# EAGLE design Finger Print Scanner (EAGLE 9.0.0)

## Sheet 1 of 2
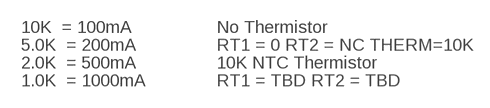
[diagram p0: schematic, sheet 1, part 1 of 2]
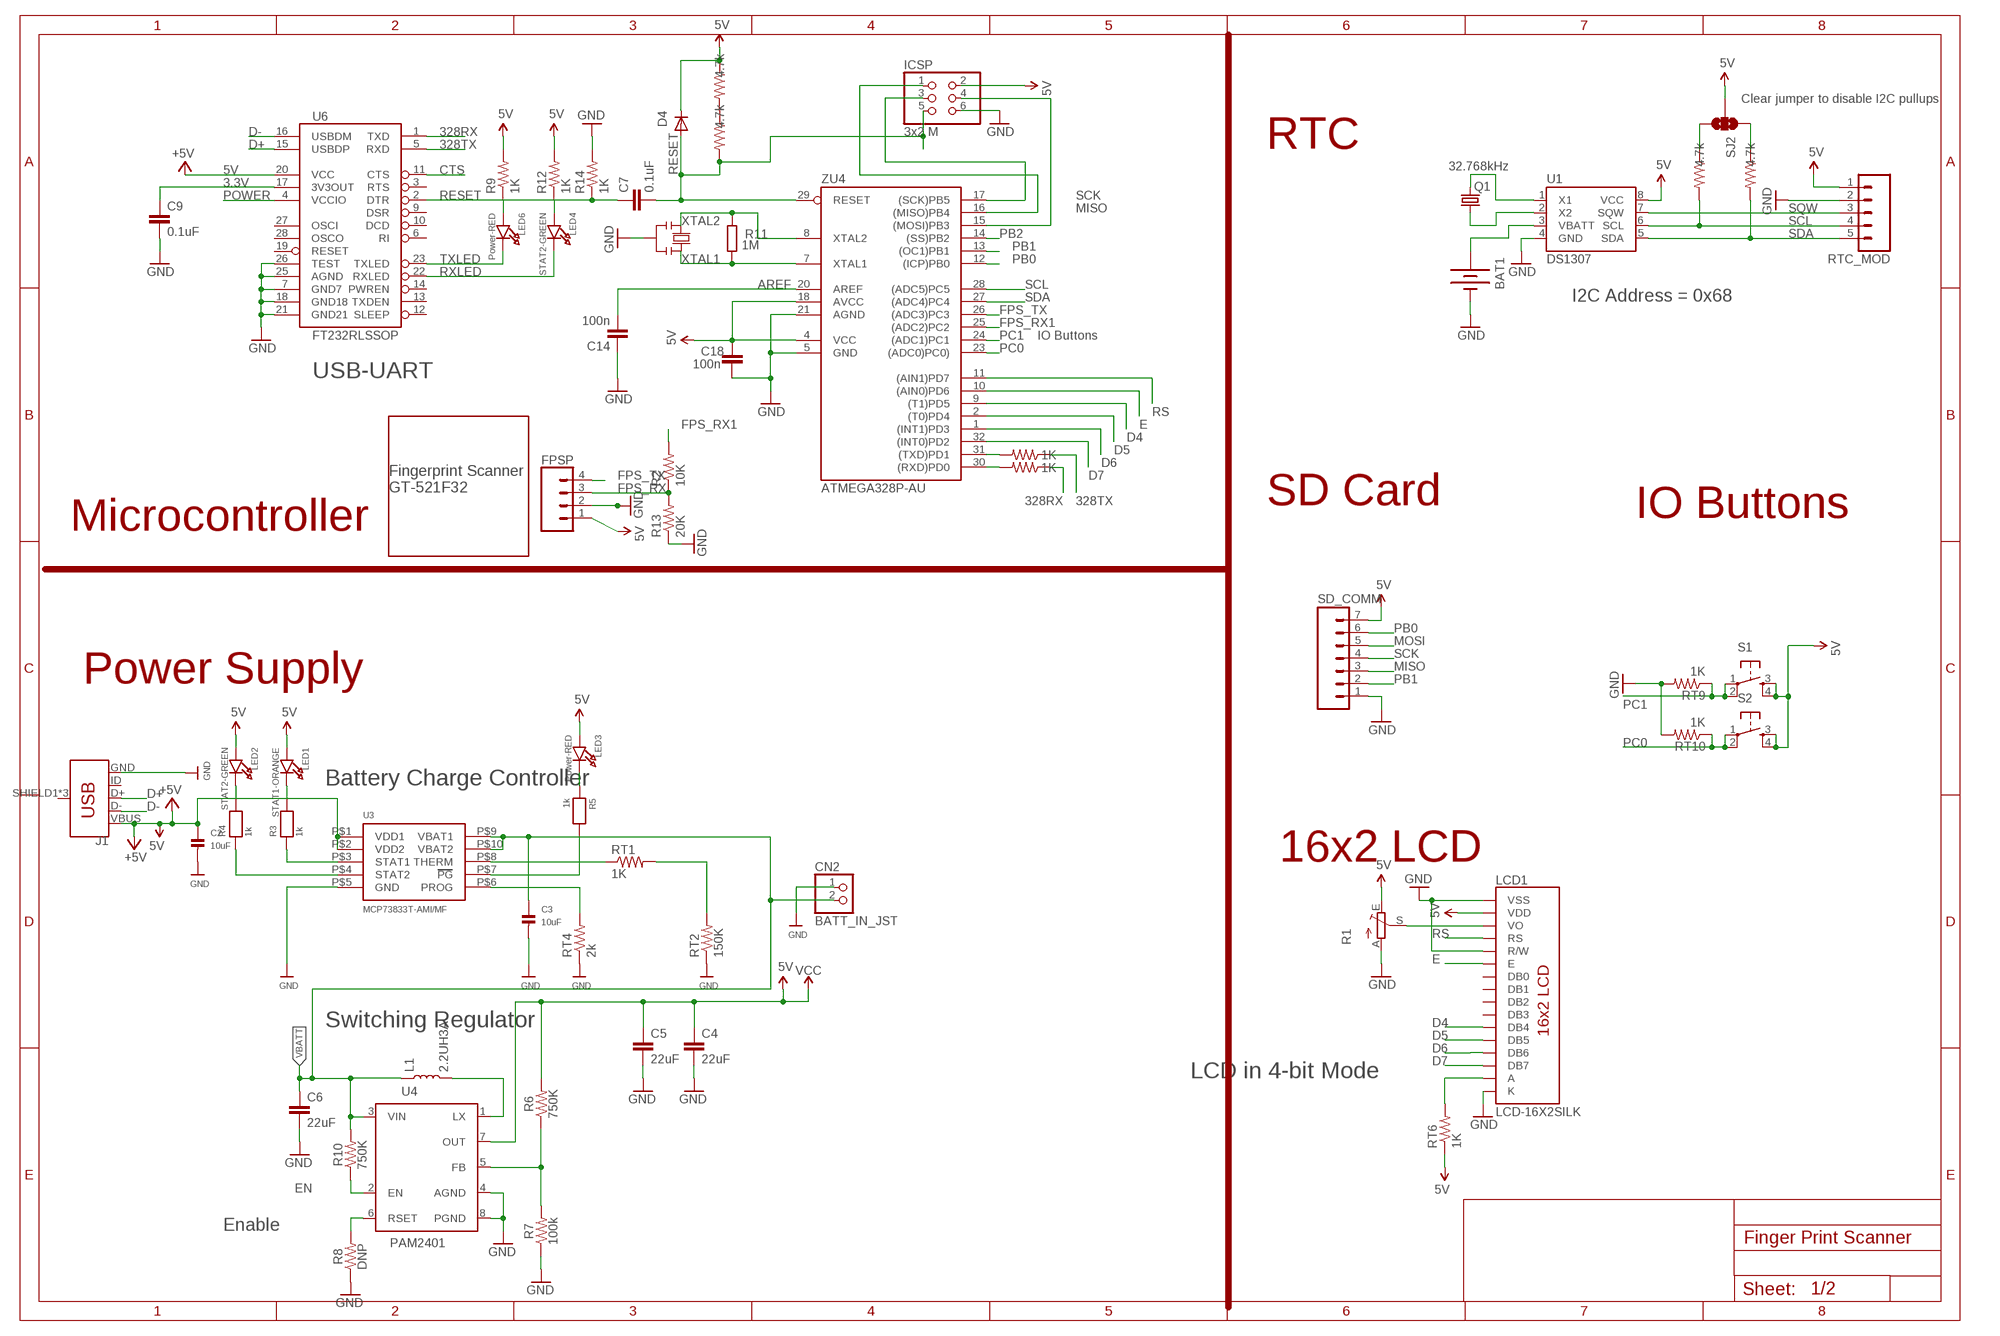
[diagram p1: schematic, sheet 1, part 2 of 2]

### Parts
BAT1  BATTERY12PTH  [BATTCON_12MM_PTH]
C2  10uF  CAP_CERAMIC0805  [0805]
C3  10uF  CAP_CERAMIC0805  [0805]
C4  22uF  22UF-0805-6.3V-20%  [0805]
C5  22uF  22UF-0805-6.3V-20%  [0805]
C6  22uF  22UF-0805-6.3V-20%  [0805]
C7  0.1uF  CAP0805  [0805]
C9  0.1uF  CAP0805  [0805]
C14  100n  C-EUC0805  [C0805]
C18  100n  C-EUC0805  [C0805]
CN2  BATT_IN_JST  JST_2PIN  [JSTPH2]
D4  DIODE-MINIMELF  [MINIMELF]
FPSP  CONN_04  [1X04]
ICSP  3x2 M  PINHD-2X3  [2X03]
J1  USB_MICRO-B_FEMALE-SMT  [USB-B-MICRO-SMD]
L1  2.2UH3A  INDUCTOR-IFSC1515AHER2R2M01  [INDUCTOR_4X4MM]
LCD1  LCD-16X2SILK  [LCD-16X2]
LED1  STAT1-ORANGE  LED0805  [CHIPLED_0805]
LED2  STAT2-GREEN  LED0805  [CHIPLED_0805]
LED3  Power-RED  LED0805  [CHIPLED_0805]
LED4  STAT2-GREEN  LED0805  [CHIPLED_0805]
LED6  Power-RED  LED0805  [CHIPLED_0805]
Q1  32.768kHz  CRYSTAL32-SMD  [CRYSTAL-32KHZ-SMD]
R1  TRIM_EU-CA6V  [CA6V]
R2  10K  RESISTOR0805-RES  [0805]
R3  1k  RESISTOR0805  [0805]
R4  1k  RESISTOR0805  [0805]
R5  1k  RESISTOR0805  [0805]
R6  750K  750KOHM-0603-1/10W-1%  [0603]
R7  100k  100KOHM-0603-1/10W-1%  [0603]
R8  DNP  100KOHM-0603-1/10W-1%  [0603]
R9  1K  RESISTOR0805-RES  [0805]
R10  750K  750KOHM-0603-1/10W-1%  [0603]
R11  1M  R-EU_R0805  [R0805]
R12  1K  RESISTOR0805-RES  [0805]
R13  20K  RESISTOR0805-RES  [0805]
R14  1K  RESISTOR0805-RES  [0805]
RT1  1K  R-US_R0805  [R0805]
RT2  150K  R-US_R0805  [R0805]
RT4  2k  R-US_R0805  [R0805]
RT6  1K  R-US_R0805  [R0805]
RT9  1K  R-US_R0805  [R0805]
RT10  1K  R-US_R0805  [R0805]
RT11  1K  R-US_R0805  [R0805]
RT12  1K  R-US_R0805  [R0805]
RT13  4.7k  R-US_R0805  [R0805]
RT14  4.7k  R-US_R0805  [R0805]
RT15  4.7k  R-US_R0805  [R0805]
RT16  4.7k  R-US_R0805  [R0805]
RTC_MOD  M05PTH  [1X05]
S1  TAC_SWITCHPTH  [TACTILE-PTH]
S2  TAC_SWITCHPTH  [TACTILE-PTH]
SD_COMM  M07  [1X07]
SJ2  SOLDERJUMPER_2WAYPASTE1&2&3  [SJ_3_PASTE1&2&3]
U1  DS1307  DS1307SO8-TIGHT  [SO08-TIGHT]
U3  MCP73833T-AMI/MF  MCP73833DFN  [DFN10_3X3MM]
U4  PAM2401  [MSOP8]
U6  FT232RLSSOP  [SSOP28DB]
U$1  GT-521F32  [GT-521F32]
Y2  RESONATORMU  [RESONATOR]
ZU4  ATMEGA328P-AU  [TQFP32-08]

### Nets
3.3V: C9.1 U6.17(3V3OUT)
5V: C2.1 C4.1 C5.1 C18.2 D4.C FPSP.1 ICSP.2 J1.VBUS LCD1.2(VDD) LED1.A LED2.A LED3.A R1.E R6.2 R9.2 R12.2 RT6.1 RT16.1 RTC_MOD.1 S1.3 S1.4 S2.3 S2.4 SD_COMM.7 SJ2.2 U1.8(VCC) U3.P$1(VDD1) U3.P$2(VDD2) U4.7(OUT) U6.20(VCC) ZU4.4(VCC) ZU4.18(AVCC) ; supply symbol labelled VCC, +5V ; also sheet 2
328RX: RT11.1 U6.1(TXD)
328RXI: RT11.2 ZU4.30((RXD)PD0)
328TX: RT12.1 U6.5(RXD)
328TXI: RT12.2 ZU4.31((TXD)PD1)
AREF [aref]: C14.2 ZU4.20(AREF)
CTS: U6.11(CTS)
D4: LCD1.11(DB4) ZU4.9((T1)PD5)
D5: LCD1.12(DB5) ZU4.2((T0)PD4)
D6: LCD1.13(DB6) ZU4.1((INT1)PD3)
D7: LCD1.14(DB7) ZU4.32((INT0)PD2)
D+: J1.D+ U6.15(USBDP)
D-: J1.D- U6.16(USBDM)
E: LCD1.6(E) ZU4.10((AIN0)PD6)
EN: R10.1 U4.2(EN)
FPS_RX: FPSP.3 R2.1 R13.2
FPS_RX1: R2.2 ZU4.25((ADC2)PC2)
FPS_TX: FPSP.4 ZU4.26((ADC3)PC3)
GND: BAT1.GND(-) C2.2 C3.2 C4.2 C5.2 C6.2 C9.2 C14.1 C18.1 CN2.1 FPSP.2 ICSP.6 J1.GND LCD1.1(VSS) LCD1.5(R/W) LCD1.16(K) R1.A R7.1 R8.1 R13.1 R14.2 RT2.1 RT4.1 RT9.2 RT10.2 RTC_MOD.2 SD_COMM.1 U1.4(GND) U3.P$5(GND) U4.4(AGND) U4.8(PGND) U6.7(GND7) U6.18(GND18) U6.21(GND21) U6.25(AGND) U6.26(TEST) Y2.2 ZU4.5(GND) ZU4.21(AGND) ; also sheet 2
MISO: ICSP.1 SD_COMM.3 ZU4.16((MISO)PB4)
MOSI: ICSP.4 SD_COMM.5 ZU4.15((MOSI)PB3)
N$1: Q1.X2 U1.1(X1)
N$2: Q1.X1 U1.2(X2)
N$3: LED1.C R3.2
N$4: BAT1.VCC@1(+) U1.3(VBATT)
N$5: RT13.1 SJ2.3
N$6: RT14.1 SJ2.1
N$7: LED2.C R4.2
N$8: R3.1 U3.P$3(STAT1)
N$9: R4.1 U3.P$4(STAT2)
N$10: R5.2 U3.P$7(PG)
N$11: RT1.1 U3.P$8(THERM)
N$12: LED3.C R5.1
N$13: RT1.2 RT2.2
N$14: R6.1 R7.2 U4.5(FB)
N$15: L1.P$2 U4.1(LX)
N$16: RT4.2 U3.P$6(PROG)
N$17: R8.2 U4.6(RSET)
N$18: RT15.1 RT16.2
N$19: LCD1.3(VO) R1.S
N$28 [usbvcc]: LCD1.15(A) RT6.2
N$33: LED6.A R9.1
N$38: LED4.A R12.1
PB0: SD_COMM.6 ZU4.12((ICP)PB0)
PB1: SD_COMM.2 ZU4.13((OC1)PB1)
PB2: ZU4.14((SS)PB2)
PC0: RT10.1 S2.1 S2.2 ZU4.23((ADC0)PC0))
PC1: RT9.1 S1.1 S1.2 ZU4.24((ADC1)PC1)
POWER: U6.4(VCCIO)
RESET: C7.1 C7.2 D4.A ICSP.5 R14.1 RT15.2 U6.2(DTR) ZU4.29(RESET)
RS: LCD1.4(RS) ZU4.11((AIN1)PD7)
RXLED: LED4.C U6.22(RXLED)
SCK: ICSP.3 SD_COMM.4 ZU4.17((SCK)PB5)
SCL: RT13.2 RTC_MOD.4 U1.6(SCL) ZU4.28((ADC5)PC5)
SDA: RT14.2 RTC_MOD.5 U1.5(SDA) ZU4.27((ADC4)PC4)
SQW: RTC_MOD.3 U1.7(SQW)
TXLED: LED6.C U6.23(TXLED)
VBATT: C3.1 C6.1 CN2.2 L1.P$1 R10.2 U3.P$9(VBAT1) U3.P$10(VBAT2) U4.3(VIN)
XTAL1: R11.1 Y2.3 ZU4.7(XTAL1)
XTAL2: R11.2 Y2.1 ZU4.8(XTAL2)
Unconnected: J1.ID J1.SHIELD1(SHIELD) J1.SHIELD2(SHIELD) J1.SHIELD3(SHIELD) LCD1.7(DB0) LCD1.8(DB1) LCD1.9(DB2) LCD1.10(DB3) U6.3(RTS) U6.6(RI) U6.9(DSR) U6.10(DCD) U6.12(SLEEP) U6.13(TXDEN) U6.14(PWREN) U6.19(RESET) U6.27(OSCI) U6.28(OSCO)

### Notes on the sheet
- Clear jumper to disable I2C pullups
- RTC
- I2C Address = 0x68
- IO Buttons
- USB-UART
- SD Card | IO Buttons
- Microcontroller
- Power Supply
- 10K  = 100mA | No Thermistor
- 5.0K  = 200mA | RT1 = 0 RT2 = NC THERM=10K
- 2.0K  = 500mA | 10K NTC Thermistor
- 1.0K  = 1000mA | RT1 = TBD RT2 = TBD
- Battery Charge Controller
- 16x2 LCD
- Switching Regulator
- LCD in 4-bit Mode
- Enable

## Sheet 2 of 2
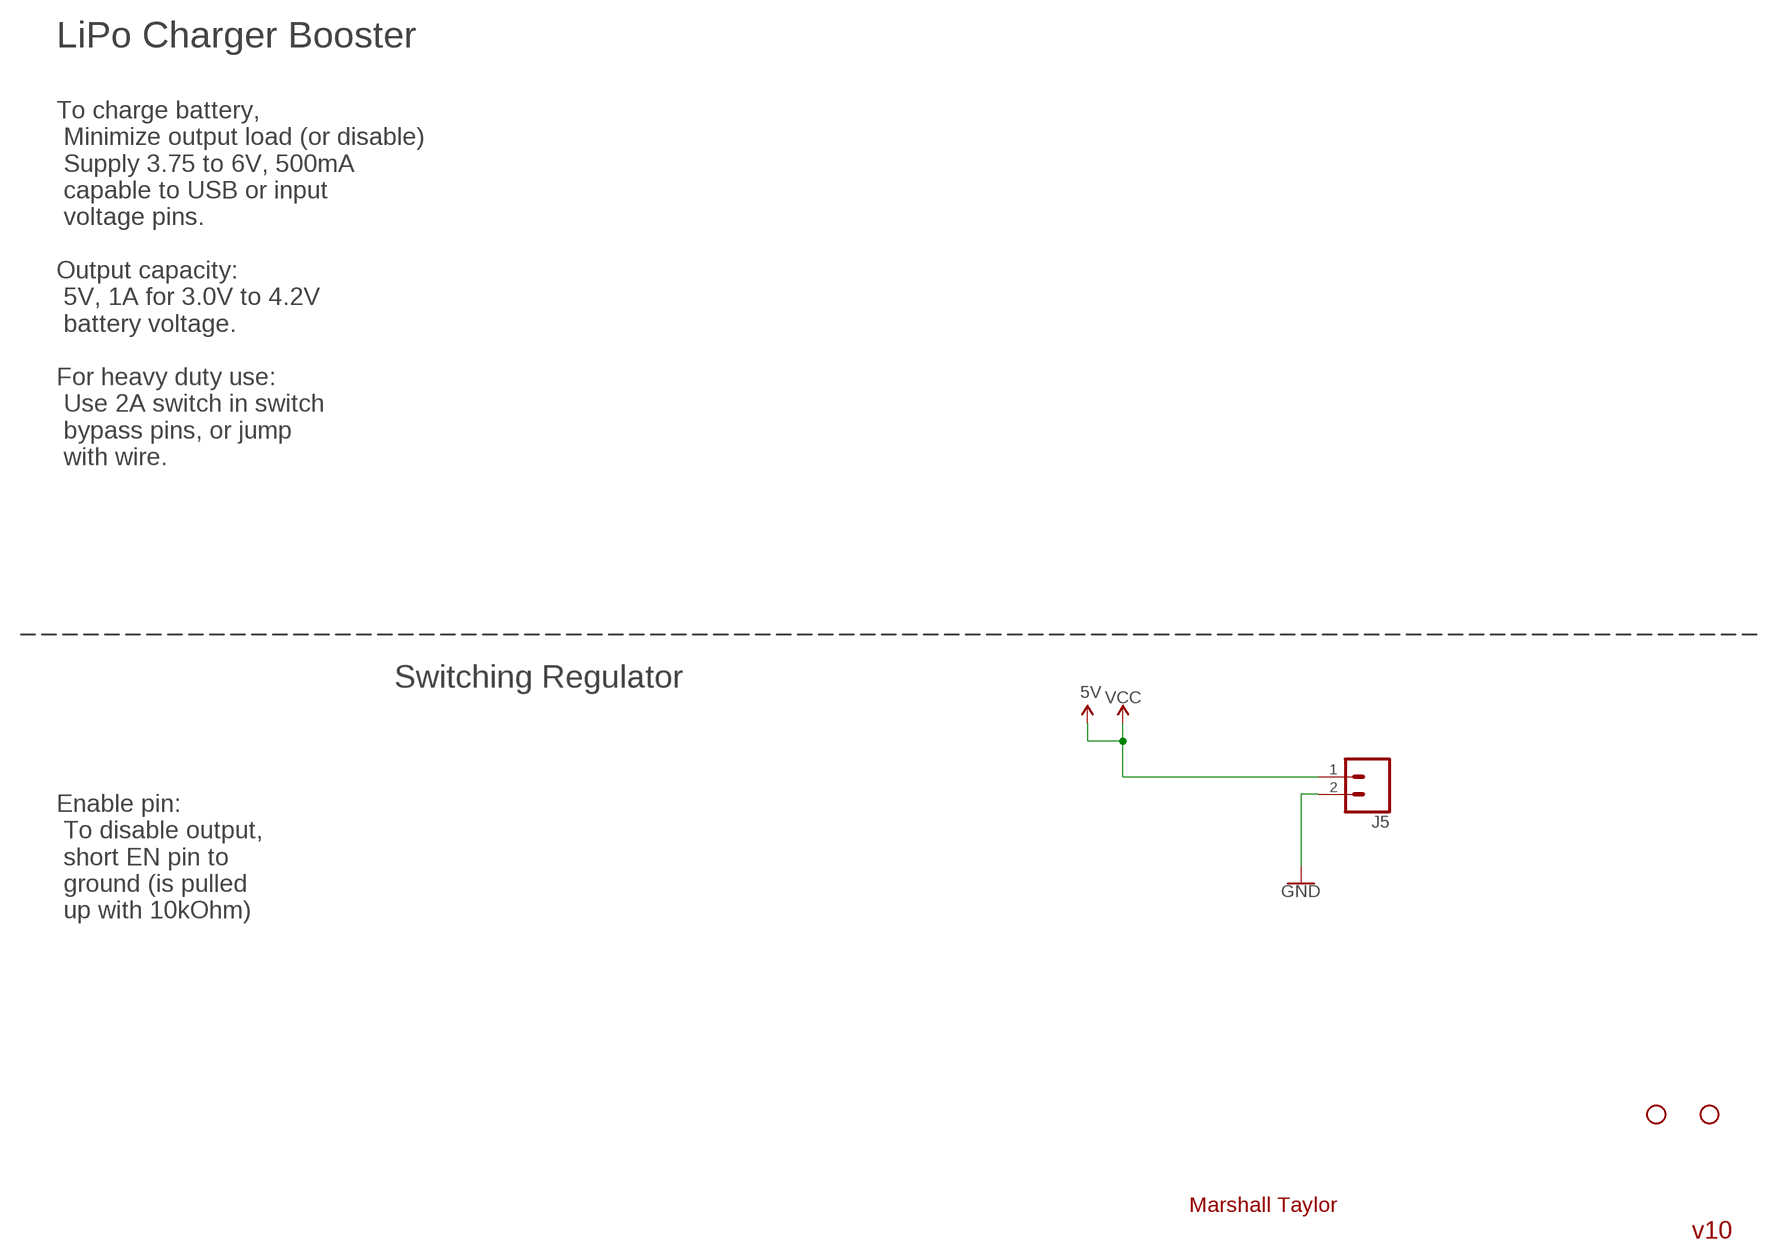
[diagram p2: schematic, sheet 2]

### Parts
J5  CONN_02  [1X02]
JP6  STAND-OFF  [STAND-OFF]
JP7  STAND-OFF  [STAND-OFF]

### Nets
5V: J5.1 ; supply symbol labelled VCC ; also sheet 1
GND: J5.2 ; also sheet 1

### Notes on the sheet
- LiPo Charger Booster
- To charge battery,
   Minimize output load (or disable)
   Supply 3.75 to 6V, 500mA
   capable to USB or input
   voltage pins.
- Output capacity:
   5V, 1A for 3.0V to 4.2V
   battery voltage.
- For heavy duty use:
   Use 2A switch in switch
   bypass pins, or jump
   with wire.
- Switching Regulator
- Enable pin:
   To disable output,
   short EN pin to
   ground (is pulled
   up with 10kOhm)
- Marshall Taylor
- v10

## Library data of the parts
BAT1 = SparkFun-Electromechanical:BATTERY: Battery Holders Various common sizes : AA, AAA, 20mm coin cell and 12mm coin cell. 20MM_4LEGS, BATT-10373
C2 C3 = microbuilder:CAP_CERAMIC: Ceramic Capacitors 0402 - 0402 Surface Mount Capacitors 16pF 50V 5% [Digikey: 445-4899-2-ND] 18pF 50V 5% [Digikey: 490-1281-2-ND] 22pF 50V 5% [Digikey: 490-1283-2-ND] 68pF 50V 5% [Digikey: 490-1289-2-ND] 0.1uF 10V 10% [Digikey: 490-1318-2-ND] 1.0uF 6.3V 10% [Digikey: 490-1320-2-ND] 0603 - 0603 Surface Mount Capacitors 16 pF 50V 5% [Digikey: 445-5051-2-ND] 22 pF 50V [Digikey: PCC220ACVTR-ND] 33 pF 50V 5% [Digikey: 490-1415-1-ND] 56pF 50V 5% [Digikey: 490-1421-1-ND] 220pF 50V 5% [Digikey: 445-1285-1-ND] 680 pF 50V 2200 pF 50V 5% C0G [Digikey: 445-1297-1-ND] 5600 pF 100V 5% X7R [Digikey: 478-3711-1-ND] 0.1 µF 25V 10% [Digikey: PCC2277TR-ND] 0.22 µF 16V 10% X7R [Digikey: 445-1318-1-ND] 1.0 µF 25V 10% [Digikey: 445-5146-2-ND] 0603 - RF Specific 3pF 250V +/-0.1pF RF [Digikey: 712-1347-1-ND] 18 pF 250V 5% [Digikey: 478-3505-1-ND or 712-1322-1-ND] 56 pF 250V 5% C0G RF [Digikey: 490-4867-1-ND] 68 pF 250V RF [Digikey: 490-4868-1-ND] 0805 - 0805 Surface Mount Capacitors 220 pF 250V 2% RF Ceramic Capacitor [Digikey: 712-1398-1-ND] 1000 pF 50V 2% NP0 Ceramic Capacitor [Digikey: 478-3760-1-ND] 0.1 µF 25V 10% Ceramic Capacitor [Digikey: PCC1828TR-ND] 1.0 µF 16V 10% Ceramic Capacitor[Digikey: 490-1691-2-ND] 10.0 µF 10V 10% Ceramic Capacitor[Digikey: 709-1228-1-ND] 10.0 uF 16V 10% Ceramic Capacitor [Digikey: 478-5165-2-ND] 47 uF 6.3V 20% Ceramic Capacitor [Digikey: 399-5506-1-ND] 1206 - 1206 Surface Mount Capacitors 47uF 10V 20% Ceramic Capacitor [Digikey: 399-5508-1-ND]
C4-C6 = SparkFun-Capacitors:22UF: 22µF ceramic capacitors A capacitor is a passive two-terminal electrical component used to store electrical energy temporarily in an electric field.; PROD_ID: CAP-08402
C7 C9 = SparkFun:CAP: Capacitor Standard 0603 ceramic capacitor, and 0.1" leaded capacitor.
C14 C18 = SmartPrj:C-EU: CAPACITOR, European symbol
CN2 = microbuilder:JST_2PIN: JST 2-Pin Right-Angle Connector PH-Series - 4UConnector: 17311 SH-Series - 4UConnector: 07278
D4 = diode:DIODE-: DIODE
FPSP = SparkFun-Connectors:CONN_04: Multi connection point. Often used as Generic Header-pin footprint for 0.1 inch spaced/style header connections On any of the 0.1 inch spaced packages, you can populate with these: Break Away Headers - Straight <https://www.sparkfun.com/products/116> (PRT-00116) Break Away Male Headers - Right Angle <https://www.sparkfun.com/products/553> (PRT-00553) Female Headers <https://www.sparkfun.com/products/115> (PRT-00115) Break Away Headers - Machine Pin <https://www.sparkfun.com/products/117> (PRT-00117) Break Away Female Headers - Swiss Machine Pin <https://www.sparkfun.com/products/743> (PRT-00743) For SCREWTERMINALS and SPRING TERMINALS visit here: Screw Terimnals on SparkFun.com <https://www.sparkfun.com/search/results?term=Screw+Terminals> (5mm/3.5mm/2.54mm spacing) This device is also useful as a general connection point to wire up your design to another part of your project. Our various solder wires solder well into these plated through hole pads. Hook-Up Wire - Assortment (Stranded, 22 AWG) <https://www.sparkfun.com/products/11375> (PRT-11375) Hook-Up Wire - Assortment (Solid Core, 22 AWG) <https://www.sparkfun.com/products/11367> (PRT-11367) View the entire wire category on our website here <https://www.sparkfun.com/categories/141> Special notes: Molex polarized connector foot print use with SKU : PRT-08231 with associated crimp pins and housings. 1MM SMD Version SKU: PRT-10208; PROD_ID: CONN-09696
ICSP = SmartPrj:PINHD-2X3: PIN HEADER
J1 = SparkFun-Connectors:USB_MICRO-B: USB Type Micro-B Connector Male/female and PTH/SMT variants SparkFun Products: SparkFun microB USB Breakout <https://www.sparkfun.com/products/12035> SparkFun USB microB Plug Breakout <https://www.sparkfun.com/products/10031> SparkFun ESP8266 Thing <https://www.sparkfun.com/products/13231>; PROD_ID: CONN-11752
J5 = SparkFun-Connectors:CONN_02: Multi connection point. Often used as Generic Header-pin footprint for 0.1 inch spaced/style header connections On any of the 0.1 inch spaced packages, you can populate with these: Break Away Headers - Straight <https://www.sparkfun.com/products/116> (PRT-00116) Break Away Male Headers - Right Angle <https://www.sparkfun.com/products/553> (PRT-00553) Female Headers <https://www.sparkfun.com/products/115> (PRT-00115) Break Away Headers - Machine Pin <https://www.sparkfun.com/products/117> (PRT-00117) Break Away Female Headers - Swiss Machine Pin <https://www.sparkfun.com/products/743> (PRT-00743) For SCREWTERMINALS and SPRING TERMINALS visit here: Screw Terimnals on SparkFun.com <https://www.sparkfun.com/search/results?term=Screw+Terminals> (5mm/3.5mm/2.54mm spacing) This device is also useful as a general connection point to wire up your design to another part of your project. Our various solder wires solder well into these plated through hole pads. Hook-Up Wire - Assortment (Stranded, 22 AWG) <https://www.sparkfun.com/products/11375> (PRT-11375) Hook-Up Wire - Assortment (Solid Core, 22 AWG) <https://www.sparkfun.com/products/11367> (PRT-11367) View the entire wire category on our website here <https://www.sparkfun.com/categories/141> Special notes: Molex polarized connector foot print use with: PRT-08233 with associated crimp pins and housings. 2.54_SCREWTERM for use with PRT-10571. 3.5mm Screw Terminal footprints for PRT-08084 5mm Screw Terminal footprints for use with PRT-08432
JP6 JP7 = SparkFun:STAND-OFF: Stand Off This is the mechanical footprint for a #4 phillips button head screw. Use the keepout ring to avoid running the screw head into surrounding components. SKU : PRT-00447
L1 = SparkFun-Coils:INDUCTOR: Inductors Resist changes in electrical current. Basically a coil of wire. SparkFun Products: SparkFun Load Cell Amplifier - HX711 <https://www.sparkfun.com/products/13879> IOIO-OTG - V2.2 <https://www.sparkfun.com/products/13613>; PROD_ID: NDUC-13770
LCD1 = SparkFun-Displays:LCD-16X2: Standard text-only 16x2 parallel input LCD Basic 16 character by 2 line display. Typically utilizes the extremely common HD44780 parallel interface chipset SparkFun Products: Basic 16x2 Green <https://www.sparkfun.com/products/255> Basic 8x2 Green <https://www.sparkfun.com/products/11122>; SF_ID: LCD-00255
LED1-LED4 LED6 = microbuilder:LED: LED 0603 - 0603 Surface Mount Package 2mA: Green LED - Low Power (3.9mcd, 2ma, 1.7Vf) - Digikey: 475-2709-2-ND Orange LED - Low Power (9.8mcd, 2ma, 1.8Vf) - Digikey: 475-1194-2-ND Red LED - Low Power (5mcd, 2ma, 1.8Vf) - Digikey: 475-1195-2-ND Yellow LED - Low Power (7mcd, 2ma, 1.8Vf) - Digikey: 475-1196-2-ND 5mA: Blue LED - Low Power (17mcd, 5ma, 2.9Vf) - Digikey: LNJ937W8CRACT-ND 0805 - 0805 Surface Mount Package 2mA: Red LED (8.8mcd, 2mA, 1.8Vf, Clear) - Low Power [Digikey: 475-2510-1-ND] Green LED (5mcd, 2mA, 1.8Vf, Clear) - Low Power [Digikey: 475-2730-1-ND] Yellow LED (11.3mcd, 2mA, 1.8Vf, Clear) - Low Power [Digikey: 475-2555-1-ND] 20mA: Red LED (104mcd, 20mA, Diffused) - LS R976 [Digikey: 475-1278-6-ND] Red LED (12mcd, 20mA, 2.0Vf, Clear) - APT2012EC [Digikey: 754-1128-1-ND] Green LED (15mcd, 20mA, 2.2Vf, Clear) - APT2012GC [Digikey: 754-1131-1-ND] Orange LED (160mcd, 20mA, 2.1Vf, Clear) - APT2012SECK [Digikey: 754-1130-1-ND] 1206 - 1206 Surface Mount Package Green LED (26mcd, 20mA, Diffused) - LG N971 [Digikey: 475-1407-6-ND] Red LED (15mcd, 20mA, Diffused) - LH N974 [Digikey: 475-1416-6-ND]
Q1 = SparkFun-FreqCtrl:CRYSTAL: Various standard crystals. Proven footprints. Spark Fun Electronics SKU : COM-00534
R1 = pot:TRIM_EU-: POTENTIOMETER
R2 R9 R12-R14 = SparkFun:RESISTOR: Resistor Basic schematic elements and footprints for 0603, 1206, and PTH resistors.
R3-R5 = microbuilder:RESISTOR: Resistors 0402 - 0402 Surface Mount Package 22 Ohm 1% 1/16W [Digikey: 311-22.0LRTR-ND] 33 Ohm 5% 1/16W 1.0K 5% 1/16W 1.5K 5% 1/16W 2.0K 1% 1/16W 10.0K 1% 1/16W [Digikey: 311-10.0KLRTR-ND] 10.0K 5% 1/16W [Digikey: RMCF0402JT10K0TR-ND] 12.1K 1% 1/16W [Digikey: 311-22.0LRTR-ND] 100.0K 5% 1/16W 0603 - 0603 Surface Mount Package 0 Ohm 1/10 Watt 1% Resistor 15 Ohm 1/10 Watt 1% Resistor 33 Ohm 1/10 Watt 1% Resistor 49.9 Ohm 1/10 Watt 1% Resistor 100 Ohm 1/10 Watt 1% Resistor 150 Ohm 1/10 Watt 1% Resistor 240 Ohm 1/10 Watt 1% Resistor 390 Ohm 1/10 Watt 1% Resistor 560 Ohm 1/10 Watt 1% Resistor 680 Ohm 1/10 Watt 1% Resistor 750 Ohm 1/10 Watt 1% Resistor 1.0K Ohm 1/10 Watt 1% Resistor 1.5K Ohm 1/10 Watt 1% Resistor 2.0K Ohm 1/10 Watt 1% Resistor 2.2K Ohm 1/10 Watt 1% Resistor 3.3K Ohm 1/10 Watt 1% Resistor 4.7K Ohm 1/10 Watt 1% Resistor 10.0K Ohm 1/10 Watt 1% Resistor 12.0K Ohm 1/10 Watt 1% Resistor 12.1K Ohm 1/10 Watt 1% Resistor 20.0K Ohm 1/10 Watt 1% Resistor 33.0K Ohm 1/10 Watt 1% Resistor 100.0K Ohm 1/10 Watt 1% Resistor 0805 - 0805 Surface Mount Package 0 Ohm 1/8 Watt 1% Resistor 33 Ohm 1/8 Watt 1% Resistor 100 Ohm 1/8 Watt 1% Resistor 150 Ohm 1/8 Watt 1% Resistor 200 Ohm 1/8 Watt 1% Resistor 240 Ohm 1/8 Watt 1% Resistor 330 Ohm 1/8 Watt 1% Resistor 390 Ohm 1/8 Watt 1% Resistor 470 Ohm 1/8 Watt 1% Resistor 1.0K Ohm 1/8 Watt 1% Resistor 1.5K Ohm 1/8 Watt 1% Resistor 2.0K Ohm 1/8 Watt 1% Resistor 4.7K Ohm 1/8 Watt 1% Resistor 5.1K Ohm 1/8 Watt 1% Resistor 5.6K Ohm 1/8 Watt 1% Resistor 10.0K Ohm 1/8 Watt 1% Resistor 22.0K Ohm 1/8 Watt 1% Resistor 33.0K Ohm 1/8 Watt 1% Resistor 100K Ohm 1/8 Watt 1% Resistor 1206 - 1206 Surface Mount Package
R6 R10 = SparkFun-Resistors:750KOHM: 750Ω resistor A resistor is a passive two-terminal electrical component that implements electrical resistance as a circuit element. Resistors act to reduce current flow, and, at the same time, act to lower voltage levels within circuits. - Wikipedia; PROD_ID: RES-13768
R7 = SparkFun-Resistors:100KOHM: 100kΩ resistor A resistor is a passive two-terminal electrical component that implements electrical resistance as a circuit element. Resistors act to reduce current flow, and, at the same time, act to lower voltage levels within circuits. - Wikipedia; PROD_ID: RES-07828
R8 = SparkFun-Resistors:100KOHM: 100kΩ resistor A resistor is a passive two-terminal electrical component that implements electrical resistance as a circuit element. Resistors act to reduce current flow, and, at the same time, act to lower voltage levels within circuits. - Wikipedia; PROD_ID: RES-07828; VALUE: 100k
R11 = SmartPrj:R-EU_: RESISTOR, European symbol
RT1 RT2 RT4 RT6 RT9-RT16 = adafruit:R-US_: RESISTOR, American symbol
RTC_MOD = SparkFun:M05: Header 5 Standard 5-pin 0.1" header. Use with straight break away headers (SKU : PRT-00116), right angle break away headers (PRT-00553), swiss pins (PRT-00743), machine pins (PRT-00117), and female headers (PRT-00115). Molex polarized connector foot print use with SKU : PRT-08230 with associated crimp pins and housings.
S1 S2 = SparkFun-Retired:TAC_SWITCH: Momentary Switch Button commonly used for reset or general input. Spark Fun Electronics SKU : COM-00097 SMT- SWCH-08247
SD_COMM = SparkFun-Connectors:M07: Header 7 Standard 7-pin 0.1" header. Use with straight break away headers (SKU : PRT-00116), right angle break away headers (PRT-00553), swiss pins (PRT-00743), machine pins (PRT-00117), and female headers (PRT-00115). NOTES ON THE VARIANTS LOCK and LOCK_LONGPADS... This footprint was designed to help hold the alignment of a through-hole component (i.e. 7-pin header) while soldering it into place. You may notice that each hole has been shifted either up or down by 0.005 of an inch from it's more standard position (which is usually a perfectly straight line). This slight alteration caused the pins (the squares in the middle) to touch the edges of the holes. Because they are alternating, it causes a "brace" to hold the header in place. 0.005 has proven to be the perfect amount of "off-center" position when using our standard breakaway headers. Although looks a little odd when you look at the bare footprint, once you have a header in there, the alteration is very hard to notice. Also, if you push a header all the way into place, it is covered up entirely on the bottom side. This idea of altering the position of holes to aid alignment will be further integrated into the Sparkfun Library for other footprints. It can help hold any component with 3 or more connection pins.
SJ2 = SparkFun-Passives:SOLDERJUMPER_2WAY: Solder Jumper 2 way solder jumper
U1 = SparkFun-FreqCtrl:DS1307: I2C real-time clock with battery backup.
U3 = microbuilder:MCP73833: Lithium-Polymer/Lithium-Ion Battery Charger [Part No.] Microchip MCP73833 MSOP10 (tube only): Digikey: MCP73833T-AMI/UN or MCP73833-FCI/UN-ND Mouser: 579-MCP73833-AMI/UN DFN10 (tape): Digikey: Note Chips ending in 'AMI' have no timer, and chips ending in 'FCI' have a 6-hour timer that will end the charge sequence after 6 horus regqrdless of current charge level.
U4 = SparkFun-IC-Power:PAM2401: PAM2401 - Boost PMIC Specifications: Up to 1A output current 0.9V to 4.75V Input Range 2.5V to 5.0V Adjustable Output Voltage Datasheet <https://www.diodes.com/assets/Datasheets/PAM2401.pdf> (Diodes inc.); PROD_ID: IC-13769
U6 = SparkFun:FT232RL: USB UART FT232RL 4th Generation USB UART (USB <-> Serial) Controller. Spark Fun Electronics SKU : COM-00650
U$1 = GT-521F32:GT-521F32
Y2 = SmartPrj:RESONATOR
ZU4 = SmartPrj:ATMEGA328P-: MICROCONTROLLER 4 Kbytes FLASH 128 bytes SRAM 256 bytes EEPROM UART 6-channel 10 bit ADC

## Net classes
0 default: width 0.152 mm, drill 0.305 mm, clearance 0.152 mm
3 usbvcc: width 0.508 mm, drill 0.61 mm, clearance 0.254 mm
4 aref: width 0.406 mm, drill 0.61 mm, clearance 0.254 mm

## Board
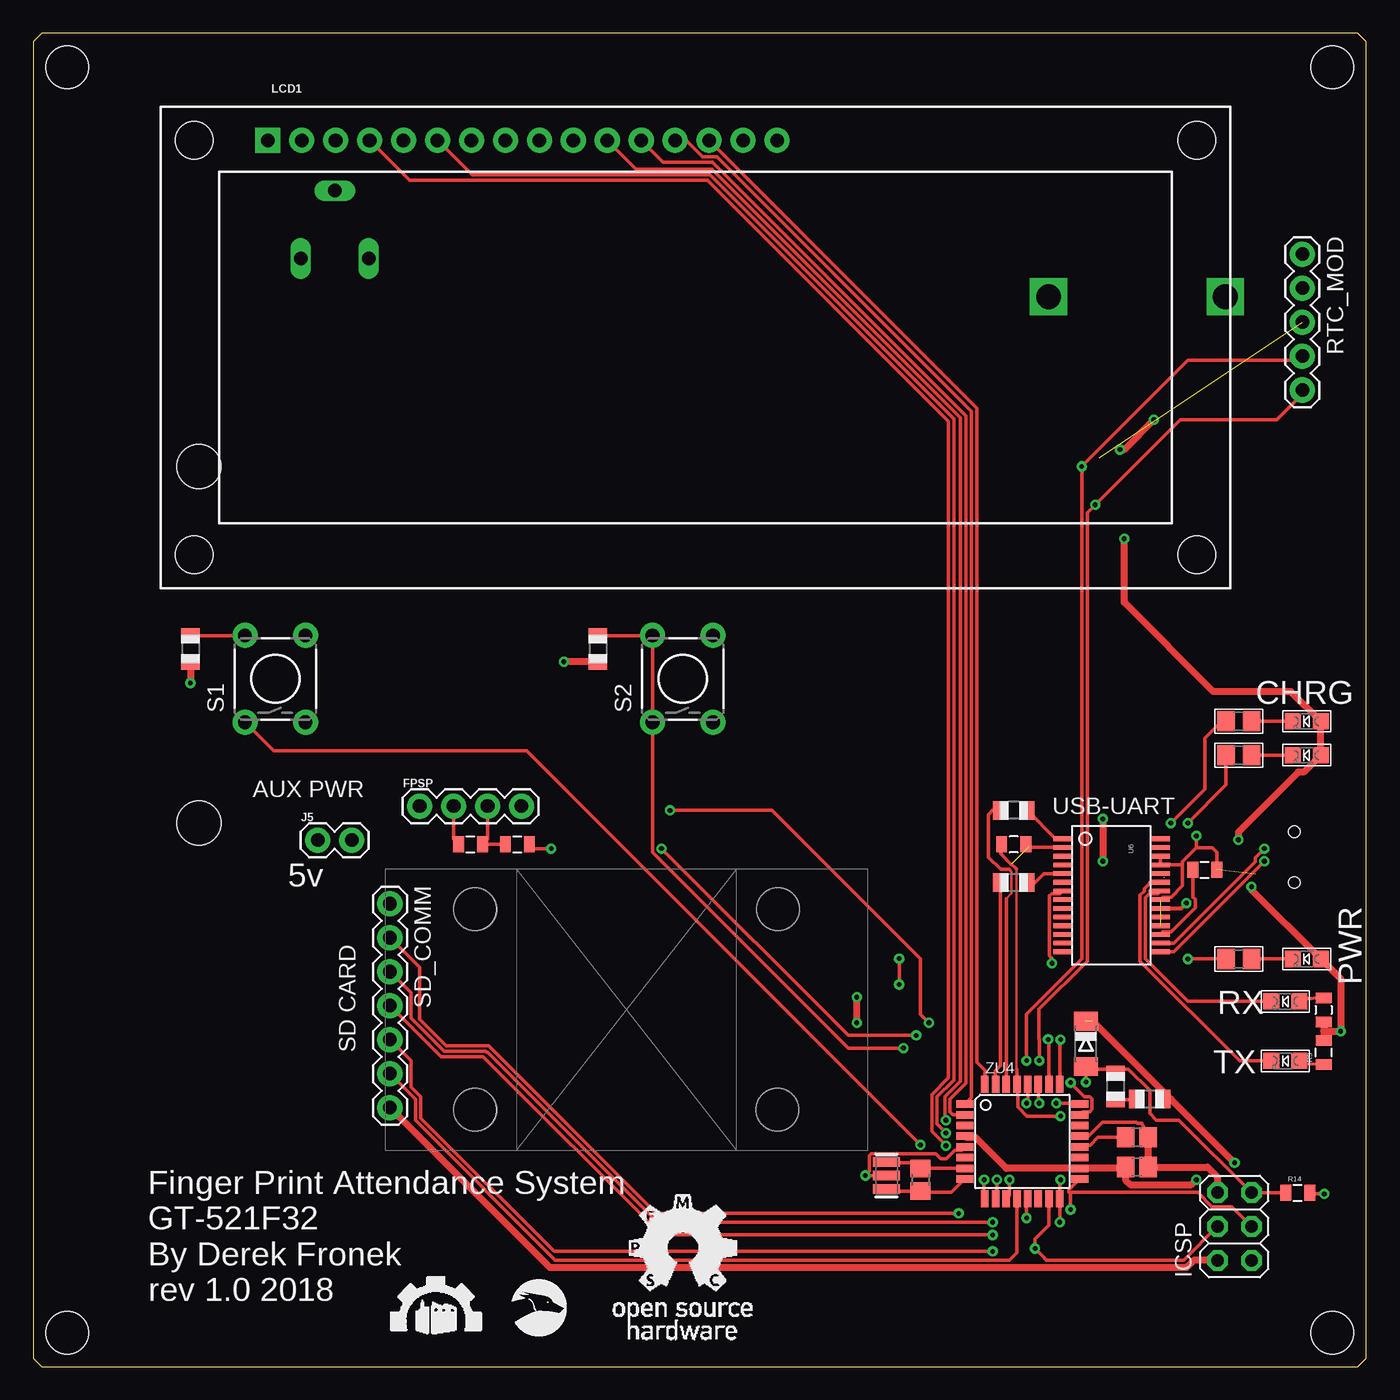
[diagram p3: board, top side]
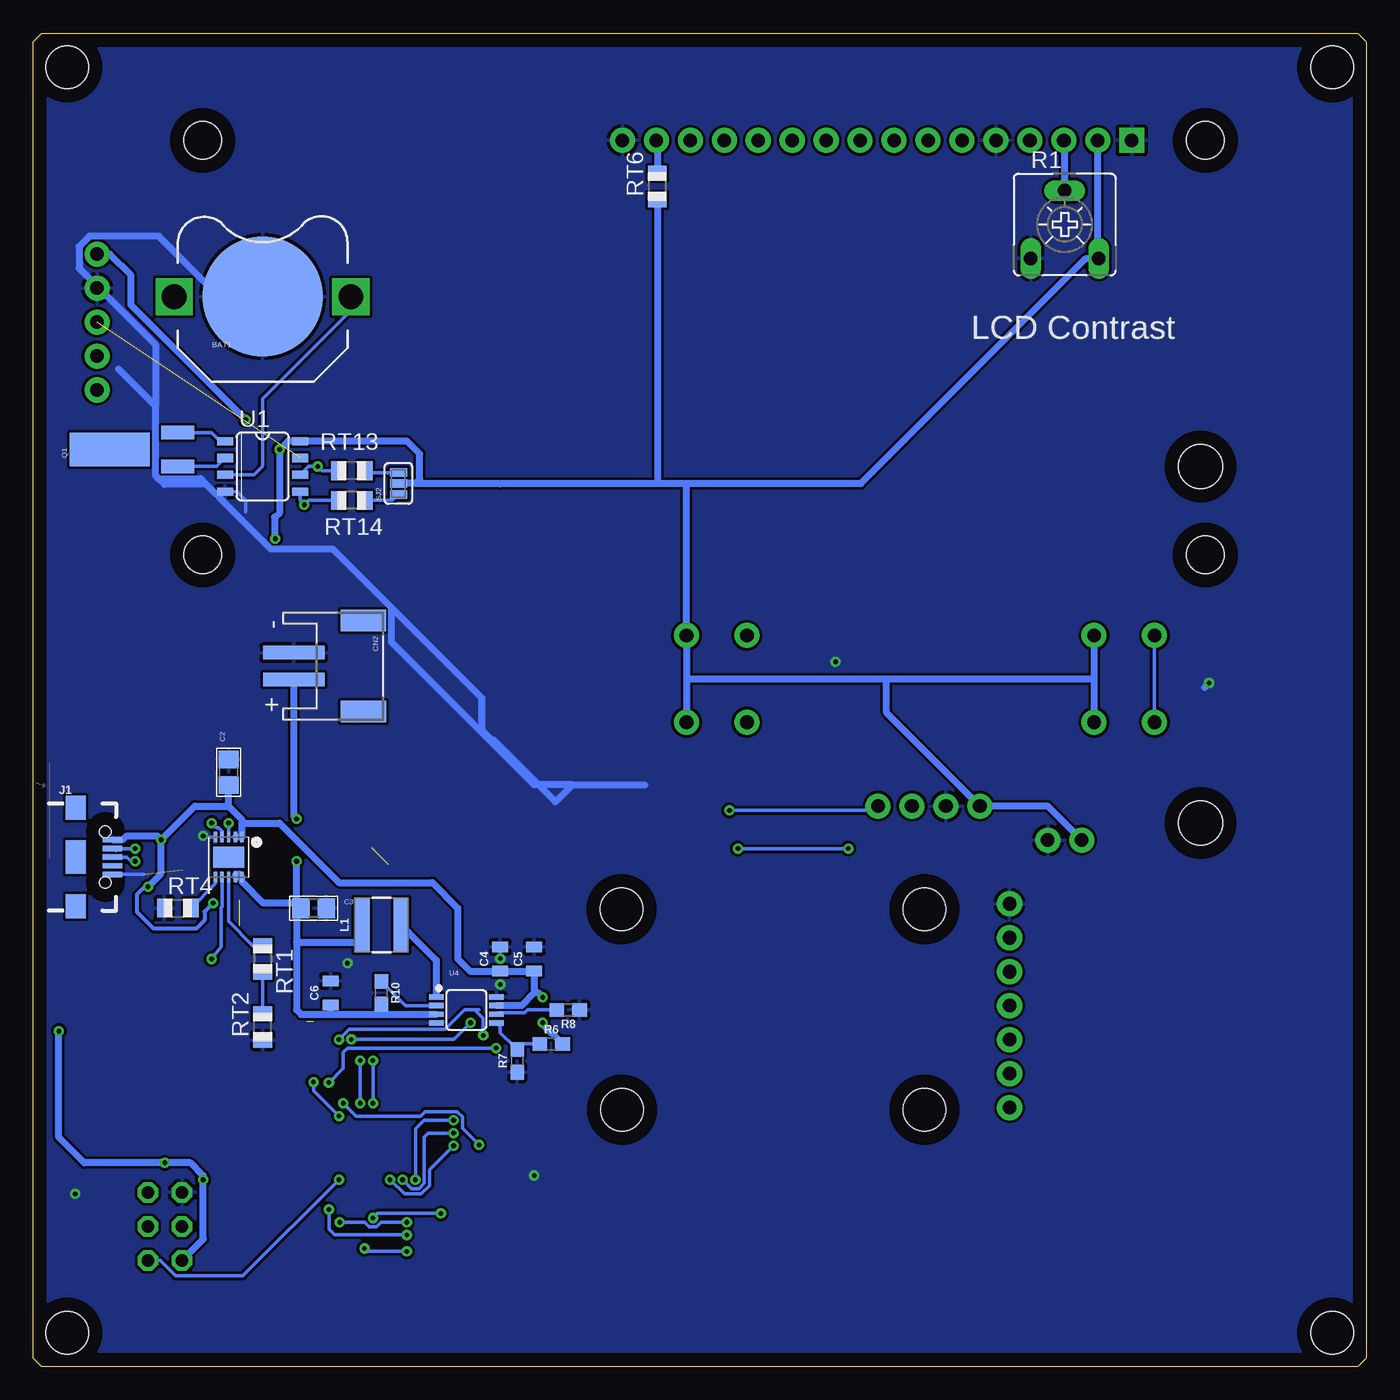
[diagram p4: board, bottom side, seen from below]

Size 99.7 x 99.69 mm. Coordinates in mm from the lower left corner, seen from the top.
Outline: 0,99.06 0,0.64 0.64,0 99.06,0 99.7,0.64 99.7,99.06 99.06,99.7 0.64,99.7 0,99.06
Copper layers (1*16): Top 0.035mm / dielectric 1.5mm / Bottom 0.035mm
Design rules "default": minimum track width 6mil, minimum drill 0.35mm, track to track 6mil, track to pad 6mil, pad to pad 6mil, via to via 6mil, smd to smd 6mil, copper to edge 40mil, drill to drill 6mil, minimum pad ring 10mil, minimum via ring 8mil, stop-mask expansion 4mil, vias tented up to drill 0mil, thermal gap 10mil
Holes 3.2 mm at 97.16,97.15 97.16,2.54 2.54,2.54 2.54,97.15

### Footprints (pad centres in the part's own frame; a part is rotated, then mirrored left to right if it is on the bottom)
BATTCON_12MM_PTH = smd 9 x 9: GND 0,0 | drill 1.854 square: VCC@1 6.604,0; VCC@2 -6.604,0
0805 = smd 1.3 x 1.5: 1 -0.95,0; 2 0.95,0
0805' = smd 0.8 x 1.2: 1 -0.9,0; 2 0.9,0
C0805 = smd 1.3 x 1.5: 1 -0.85,0; 2 0.85,0
JSTPH2 = smd 1 x 4.6: 1 -1,-3.7; 2 1,-3.7 | smd 1.6 x 3.4: NC1 -3.4,1.5; NC2 3.4,1.5
MINIMELF = smd 1.4 x 1.8: A 1.7,0; C -1.7,0
1X04 = drill 1.016 pad 1.88: 1 0,0; 2 2.54,0; 3 5.08,0; 4 7.62,0
2X03 = drill 0.95 pad 1.55 octagon: 1 -2.54,-1.27; 2 -2.54,1.27; 3 0,-1.27; 4 0,1.27; 5 2.54,-1.27; 6 2.54,1.27
USB-B-MICRO-SMD = smd 1.45 x 0.4: D+ 2.725,0; D- 2.725,0.65; GND 2.725,-1.3; ID 2.725,-0.65; VBUS 2.725,1.3 | smd 1.5 x 1.8: SHIELD1 0,3.685; SHIELD2 0,-3.685 | smd 1.5 x 2.5: SHIELD3 0,0 | hole 0.85: 2.2,1.9; 2.2,-1.9
1X02 = drill 1.016 pad 1.88: 1 0,0; 2 2.54,0
STAND-OFF = hole 3.302: 0,0
INDUCTOR_4X4MM = smd 4.089 x 1.143: P$1 0,1.473; P$2 0,-1.473
LCD-16X2 = drill 1.016 pad 1.88 square: 1 -32,15.5 | drill 1.016 pad 1.88: 2 -29.46,15.5; 3 -26.92,15.5; 4 -24.38,15.5; 5 -21.84,15.5; 6 -19.3,15.5; 7 -16.76,15.5; 8 -14.22,15.5; 9 -11.68,15.5; 10 -9.14,15.5; 11 -6.6,15.5; 12 -4.06,15.5; 13 -1.52,15.5; 14 1.02,15.5; 15 3.56,15.5; 16 6.1,15.5 | hole 2.8: -37.5,15.5; -37.5,-15.5; 37.5,15.5; 37.5,-15.5
CHIPLED_0805 = smd 1.2 x 1.2: A 0,-1.05; C 0,1.05
CRYSTAL-32KHZ-SMD = smd 2.5 x 6: SHEILD 0,5.08 | smd 1 x 2.5: X1 -1.27,0; X2 1.27,0
CA6V = drill 1.016 long: A -2.54,-2.54; E 2.54,-2.54; S 0,2.54
0603 = smd 1.1 x 1: 1 -0.85,0; 2 0.85,0
R0805 = smd 1.3 x 1.5: 1 -0.85,0; 2 0.85,0
R0805' = smd 1.1 x 1.4: 1 -1,0; 2 1,0
1X05 = drill 1.016 pad 1.88: 1 0,0; 2 2.54,0; 3 5.08,0; 4 7.62,0; 5 10.16,0
TACTILE-PTH = drill 1.016 pad 1.88: 1 -3.251,2.261; 2 3.251,2.261; 3 -3.251,-2.261; 4 3.251,-2.261
1X07 = drill 1.016 pad 1.88: 1 0,0; 2 2.54,0; 3 5.08,0; 4 7.62,0; 5 10.16,0; 6 12.7,0; 7 15.24,0
SJ_3_PASTE1&2&3 = smd 0.635 x 1.27: 1 -0.813,0; 2 0,0; 3 0.813,0
SO08-TIGHT = smd 0.6 x 1.2: 1 -1.905,-2.8; 2 -0.635,-2.8; 3 0.635,-2.8; 4 1.905,-2.8; 5 1.905,2.8; 6 0.635,2.8; 7 -0.635,2.8; 8 -1.905,2.8
DFN10_3X3MM = smd 2.35 x 1.58: GND 0,0 | smd 0.25 x 0.8: P$1 -1,-1.5; P$2 -0.5,-1.5; P$3 0,-1.5; P$4 0.5,-1.5; P$5 1,-1.5; P$6 1,1.5; P$7 0.5,1.5; P$8 0,1.5; P$9 -0.5,1.5; P$10 -1,1.5
MSOP8 = smd 0.4 x 1.1: 1 -0.975,-2.25; 2 -0.325,-2.25; 3 0.325,-2.25; 4 0.975,-2.25; 5 0.975,2.25; 6 0.325,2.25; 7 -0.325,2.25; 8 -0.975,2.25
SSOP28DB = smd 0.348 x 1.397: 1 -4.225,-3.656; 2 -3.575,-3.656; 3 -2.925,-3.656; 4 -2.275,-3.656; 5 -1.625,-3.656; 6 -0.975,-3.656; 7 -0.325,-3.656; 8 0.325,-3.656; 9 0.975,-3.656; 10 1.625,-3.656; 11 2.275,-3.656; 12 2.925,-3.656; 13 3.575,-3.656; 14 4.225,-3.656; 15 4.225,3.656; 16 3.575,3.656; 17 2.925,3.656; 18 2.275,3.656; 19 1.625,3.656; 20 0.975,3.656; 21 0.325,3.656; 22 -0.325,3.656; 23 -0.975,3.656; 24 -1.625,3.656; 25 -2.275,3.656; 26 -2.925,3.656; 27 -3.575,3.656; 28 -4.225,3.656
GT-521F32 = hole 3.2: 6.7,3; 29.3,3; 29.35,18; 6.7,18
RESONATOR = smd 0.7 x 2: 1 -1,0; 2 0,0; 3 1,0
TQFP32-08 = smd 1.27 x 0.559: 1 -4.293,2.8; 2 -4.293,2; 3 -4.293,1.2; 4 -4.293,0.4; 5 -4.293,-0.4; 6 -4.293,-1.2; 7 -4.293,-2; 8 -4.293,-2.8; 17 4.293,-2.8; 18 4.293,-2; 19 4.293,-1.2; 20 4.293,-0.4; 21 4.293,0.4; 22 4.293,1.2; 23 4.293,2; 24 4.293,2.8 | smd 0.559 x 1.27: 9 -2.8,-4.293; 10 -2,-4.293; 11 -1.2,-4.293; 12 -0.4,-4.293; 13 0.4,-4.293; 14 1.2,-4.293; 15 2,-4.293; 16 2.8,-4.293; 25 2.8,4.293; 26 2,4.293; 27 1.2,4.293; 28 0.4,4.293; 29 -0.4,4.293; 30 -1.2,4.293; 31 -2,4.293; 32 -2.8,4.293

### Placement (x,y rotation side)
BAT1  82.55,80.01 0 bottom
C2  85.09,44.45 90 bottom
C3  78.74,34.29 0 bottom
C4  22uF  [0805']  64.77,30.48 90 bottom
C5  22uF  [0805']  62.23,30.48 90 bottom
C6  22uF  [0805']  77.47,27.94 90 bottom
C7  0.1uF  [0805']  73.34,39.05 180 top
C9  0.1uF  [0805']  87.63,37.15 0 top
C14  82.55,17.14 180 top
C18  82.55,14.92 180 top
CN2  76.52,52.39 270 bottom
D4  78.74,24.13 270 top
FPSP  28.89,41.91 0 top
ICSP  89.85,10.48 90 top
J1  96.52,38.1 0 bottom
J5  21.27,39.37 0 top
JP6  12.38,40.64 0 top
JP7  12.38,67.31 0 top
L1  73.66,33.02 90 bottom
LCD1  49.53,76.2 0 top
LED1  95.25,48.26 90 top
LED2  95.25,45.72 90 top
LED3  95.25,30.48 90 top
LED4  93.66,27.3 90 top
LED6  93.66,22.86 90 top
Q1  88.9,68.58 90 bottom
R1  22.54,85.41 0 bottom
R2  10K  [0805']  36.2,39.05 0 top
R3  90.17,48.26 0 top
R4  90.17,45.72 0 top
R5  90.17,30.48 180 top
R6  60.96,24.13 0 bottom
R7  63.5,22.86 90 bottom
R8  59.69,26.67 180 bottom
R9  1K  [0805']  96.52,23.49 90 top
R10  73.66,27.94 270 bottom
R11  66.36,13.97 270 top
R12  1K  [0805']  96.52,26.67 270 top
R13  20K  [0805']  32.7,39.05 0 top
R14  1K  [0805']  94.58,12.99 0 top
RT1  1K  [R0805']  82.55,30.48 270 bottom
RT2  150K  [R0805']  82.55,25.4 90 bottom
RT4  2k  [R0805']  88.9,34.29 0 bottom
RT6  1K  [R0805']  53.02,88.26 90 bottom
RT9  1K  [R0805']  11.75,53.66 270 top
RT10  1K  [R0805']  42.23,53.66 270 top
RT11  1K  [R0805']  73.34,41.59 180 top
RT12  1K  [R0805']  73.34,36.19 180 top
RT13  4.7k  [R0805']  75.88,66.99 180 bottom
RT14  4.7k  [R0805']  75.88,64.77 180 bottom
RT15  4.7k  [R0805']  80.96,20.95 90 top
RT16  4.7k  [R0805']  83.5,20 180 top
RTC_MOD  94.93,83.18 270 top
S1  18.1,51.43 90 top
S2  48.58,51.43 90 top
SD_COMM  26.67,34.61 270 top
SJ2  72.39,66.04 90 bottom
U1  82.55,67.31 270 bottom
U3  85.09,38.1 180 bottom
U4  67.31,26.67 270 bottom
U6  80.64,35.24 270 top
U$1  26.35,16.19 0 top
Y2  63.82,14.29 90 top
ZU4  73.98,16.83 0 top

### Tracks (layer width: path | path; a pad name or v marks a point on that pad's centre or on a via)
3.3V
  Top 0.254: U6.17 84.5,32.51 85.12,32.51 86.91,34.31 86.91,34.93 86.73,35.11 C9.1
5V  (via drill 0.35)  (1 unrouted)
  Top 0.254: RT16.1 85.09,20
  Top 0.305: U6.20 85.86,34.27 v86.25,34.66
  Top 0.508: v81.6,61.91 81.6,57.15 88.27,50.48 94.08,50.48 LED1.A LED2.A 95.03,44.45 94.62,44.45 90.14,39.98 v90.14,39.4 | v91.12,35.88 91.12,35.66 LED3.A 97.79,28.99 v97.79,25.08 96.52,25.08 | ZU4.4 69.8,17.11 70.49,17.11 72.77,14.83 ZU4.18 81.57,14.83 C18.2 81.7,13.95 82.05,13.6 86.62,13.6 v87,13.97 | ICSP.2 86.8,7.94 86.28,7.42 38.62,7.42 SD_COMM.7 | 79.26,25.83 85.09,20 v89.85,15.24 | v61.6,25.72 v61.6,27.62 | R12.2 96.52,25.08 | 96.52,25.08 R9.2 | v83.82,70.8 81.6,68.58 v81.28,68.58
  Bottom 0.254: 81.65,63.55 81.28,63.92 v81.28,68.58 | 80.65,69.22 U1.8 78.74,69.22
  Bottom 0.305: v86.25,34.66 86.89,34.02 86.89,33.39 87.52,32.75 90.7,32.75 91.97,34.02 91.97,35.29 91.38,35.88 v91.12,35.88
  Bottom 0.508: 85.09,41.91 87.63,41.91 v90.14,39.4 | 85.09,41.91 84.09,40.91 84.09,40.64 | 62.23,27.94 63.18,27 U4.7 | 62.23,27.94 C5.1 C4.1 67.05,29.58 67.95,30.48 67.95,34.29 69.85,36.2 76.84,36.2 81.28,40.64 84.09,40.64 | v81.6,61.91 81.6,63.5 | 81.6,63.5 81.65,63.55 | v90.14,39.4 90.14,36.86 v91.12,35.88 | ICSP.2 87,9.53 v87,13.97 87,14.29 87.95,15.24 v89.85,15.24 95.89,15.24 97.79,17.15 v97.79,25.08 | 71.12,66.04 70.8,66.36 70.8,68.26 71.76,69.22 78.74,69.22 80.65,69.22 v81.28,68.58 81.28,63.82 81.6,63.5 | J1.VBUS 93,39.4 92.71,39.69 90.43,39.69 v90.14,39.4 | S1.4 20.36,51.44 | 20.36,51.44 S1.3 | 50.84,51.44 S2.4 50.84,66 50.8,66.04 | 50.84,51.44 S2.3 | 50.84,51.44 35.88,51.44 | 35.88,51.44 20.36,51.44 | R6.2 61.6,25.62 v61.6,25.72 | v61.6,27.62 61.91,27.94 62.23,27.94 | 84.09,40.64 U3.P$1 U3.P$2 | 85.09,41.91 C2.1 | 71.12,66.04 SJ2.2 | 71.12,66.04 64.77,66.04 | 64.77,66.04 53.02,66.04 | 53.02,66.04 50.8,66.04 | 50.8,66.04 37.78,66.04 20.96,82.87 R1.E 20.07,82.94 LCD1.2 | 64.81,66 64.77,66.04 | RT6.1 53.02,66.04 | RTC_MOD.1 93.98,83.19 92.39,81.6 92.39,79.38 v83.82,70.8 | 35.88,51.44 35.88,48.9 FPSP.1 23.81,41.91 J5.1
328RX
  Top 0.254: RT11.1 76.47,39.47 U6.1
328RXI
  Top 0.203: 72.78,34.99 73.17,35.38 73.17,37.01 73.01,37.17
  Top 0.254: RT11.2 71.76,41.59 71.44,41.28 71.44,38.1 72.36,37.17 73.01,37.17 | 72.78,34.99 ZU4.30
328TX
  Top 0.254: RT12.1 74.93,36.2 75.6,36.87 U6.5
328TXI
  Top 0.254: RT12.2 72.34,22.5 71.98,22.13 ZU4.31
AREF
  Top 0.254: ZU4.20 78.41,16.57 79.06,16.57 79.64,17.15 C14.2
D4  (via drill 0.35)
  Top 0.254: LCD1.11 45.1,89.54 50.76,89.54 69.35,70.95 69.35,21.35 68.17,20.17 68.17,18.5 v68.26,18.42 | v71.12,13.97 71.12,12.59 ZU4.9
  Bottom 0.254: v68.26,18.42 70.49,18.42 71.12,17.78 v71.12,13.97
D5
  Top 0.254: LCD1.12 47.1,90.07 50.8,90.07 69.76,71.11 69.76,21.18 68.58,20 68.58,19.05 68.8,18.83 ZU4.2
D6
  Top 0.254: 70.17,71.45 70.17,71.44 | LCD1.13 48.83,91.7 50.05,90.48 51.12,90.48 70.17,71.44 | ZU4.1 70.17,20.11 70.17,71.44
D7
  Top 0.254: ZU4.32 71.18,22.17 70.57,22.77 70.57,71.68 LCD1.14
D+  (via drill 0.35)
  Top 0.254: U6.15 85.31,31.02 v92.08,37.78
  Bottom 0.254: v92.08,37.78 92.39,37.78 92.71,38.1 J1.D+
D-  (via drill 0.35)
  Top 0.254: U6.16 85.33,31.67 91.42,37.76 91.42,38.06 92.08,38.71 v92.08,38.74
  Bottom 0.254: v92.08,38.74 93.03,38.74 | 93.03,38.74 93.37,38.74 93.52,38.58 | J1.D- 93.04,38.75 93.03,38.74
E  (via drill 0.35)
  Top 0.254: LCD1.6 32.8,89.13 50.6,89.13 68.85,70.88 68.85,21.42 67.61,20.18 67.61,18.14 68.26,17.49 v68.26,17.46 | v72.07,13.97 72.07,12.63 ZU4.10
  Bottom 0.254: v68.26,17.46 70.17,17.46 70.46,17.17 70.46,13.7 70.85,13.31 71.39,13.31 72.05,13.97 v72.07,13.97
EN
  Bottom 0.254: R10.1 71.87,27 U4.2
FPS_RX
  Top 0.254: FPSP.3 33.97,39.42 33.63,39.08 | 33.63,39.08 R13.2 | R2.1 33.66,39.05 33.63,39.08
FPS_RX1  (via drill 0.35)
  Top 0.254: ZU4.25 76.78,24.39 v76.84,24.45 | v66.04,24.77 60.96,24.77 v46.99,38.74 | v38.74,38.74 37.41,38.74 R2.2
  Bottom 0.254: v76.84,24.45 76.56,24.72 76.56,24.74 76.09,25.22 68.89,25.22 67.44,26.67 66.68,26.67 | 66.68,26.67 66.36,26.67 | 66.68,26.67 66.04,26.04 v66.04,24.77 | v46.99,38.74 v38.74,38.74
FPS_TX  (via drill 0.35)
  Top 0.254: ZU4.26 75.98,24.4 v75.91,24.47 | v66.99,25.72 66.36,26.35 66.36,30.48 55.25,41.59 v47.63,41.59
  Bottom 0.254: v75.91,24.47 68.24,24.47 v66.99,25.72 | v47.63,41.59 36.83,41.59 FPSP.4
GND  (via drill 0.35)  (2 unrouted)
  Top 0.254: Y2.2 v62.23,14.29 62.54,14.6 62.54,15.75 62.7,15.92 67.53,15.92 67.88,15.56 68.31,15.56 68.93,16.19 69.44,16.19 ZU4.5 | U6.21 84.5,35.11 85.12,35.11 85.95,35.95 85.95,37.47 | 88.23,37.15 C9.2 88.53,38.47 88.2,38.81 87,38.81 | 85.95,37.47 85.95,37.76 87,38.81 | 85.95,37.47 85.9,37.52 U6.25 U6.26 | U6.7 76.79,35.37 76.17,35.37 76.01,35.21 76.01,30.73 76.2,30.54 v76.2,30.16 | R13.1 31.43,39.42 FPSP.2 | v64.77,30.51 v64.77,28.58 | ZU4.21 78.93,17.23 79.98,18.28 82.51,18.28 82.57,18.21 82.92,18.21 C14.1 | 87,38.81 v87,39.69 | R14.2 95.56,12.91 v96.56,12.91
  Top 0.508: RT10.2 42.18,52.71 v39.69,52.71 | RT9.2 v11.75,51.12 | ICSP.6 88.58,14.19 87.85,14.92 C18.1 C14.1
  Bottom 0.254: 83.82,63.92 83.82,64.77 84.46,65.41 U1.4 | J1.GND 93.77,36.83 91.44,36.83 | U3.P$5 86.91,39.6 v87,39.69 | C4.2 v64.77,30.51 | v96.56,12.91 96.56,12.99
  Bottom 0.508: 86.76,65.97 89.88,65.97 90.32,66.4 | 86.76,65.97 81.92,61.13 77.28,61.13 72.91,56.76 | 72.91,56.76 66.15,50 66.15,47.63 65.37,46.84 65.25,46.84 60.64,42.23 59.37,43.5 | BAT1.GND 85.8,80.01 90.32,84.53 95.49,84.53 96.28,83.74 96.28,82.15 90.56,76.43 90.56,71.82 | 59.37,43.5 53.98,43.5 | 59.37,43.5 62.23,43.5 72.91,54.18 72.91,56.76 | 90.32,66.4 90.56,66.64 90.56,71.82 | 90.56,71.82 93.35,74.61 | 90.32,66.4 87.2,66.4 86.76,65.97 | v11.75,51.12 12.07,50.8
  pour Bottom (isolate 0.203): -0.69,-0.53 100.23,-0.53 100.23,100.53 -0.69,100.53
MISO  (via drill 0.35)
  Top 0.254: v76.78,10.8 ZU4.16 76.78,13.91 v76.84,13.97 | SD_COMM.3 28.26,27.94 28.26,26.04 30.71,23.58 33.82,23.58 33.91,23.5 33.97,23.5 46.67,10.8 v71.76,10.8
  Bottom 0.254: ICSP.1 90.22,7.94 89.06,6.78 84.02,6.78 v76.84,13.97 | 76.84,10.8 v76.78,10.8 74.91,10.8 74.57,10.46 74.02,10.46 73.68,10.8 v71.76,10.8
MOSI  (via drill 0.35)
  Top 0.254: ZU4.15 75.98,10.57 74.93,9.53 v74.93,8.83 75.62,8.14 75.62,8.12 75.78,7.95 86.06,7.95 ICSP.4 | SD_COMM.5 28.26,22.86 28.26,20.89 28.98,20.17 28.98,18.58 38.95,8.61 v71.76,8.61
  Bottom 0.254: v71.76,8.61 74.71,8.61 v74.93,8.83
N$1
  Bottom 0.254: U1.1 85.73,69.22 86.36,69.85 Q1.X2
N$2
  Bottom 0.254: U1.2 85.99,67.31 Q1.X1
N$3
  Top 0.254: R3.2 LED1.C
N$4
  Bottom 0.254: U1.3 83.19,66.68 82.55,67.31 82.55,72.39 75.95,78.99 BAT1.VCC@1
N$5
  Bottom 0.152: RT13.1 74.88,66.86 74.89,66.85
  Bottom 0.254: 74.89,66.85 SJ2.3
N$6
  Bottom 0.254: SJ2.1 72.85,64.77 RT14.1
N$7
  Top 0.254: R4.2 LED2.C
N$8  (via drill 0.35)
  Top 0.254: v85.09,40.64 87.63,43.18 87.63,46.99 88.9,48.26 R3.1
  Bottom 0.254: U3.P$3 v85.09,40.64
N$9  (via drill 0.35)
  Top 0.254: v86.36,40.64 89.22,43.5 R4.1
  Bottom 0.254: v86.36,40.64 86,40.28 85.85,40.28 85.59,40.02 U3.P$4
N$10  (via drill 0.35)
  Top 0.254: v86.36,30.48 R5.2
  Bottom 0.254: v86.36,30.48 85.67,31.4 85.67,34.31 85.59,34.38 U3.P$7
N$11
  Bottom 0.254: U3.P$8 85.09,33.29 83.28,31.48 RT1.1
N$12
  Top 0.254: R5.1 LED3.C
N$13
  Bottom 0.254: RT1.2 RT2.2
N$14
  Bottom 0.254: U4.5 64.77,25.41 64.77,24.98 63.71,23.92 | 63.71,23.92 R7.2 | R6.1 63.5,24.13 63.71,23.92
N$15
  Bottom 0.254: L1.P$2 71.65,32.49 | 69.56,27.94 U4.1
  Bottom 0.508: 71.65,32.49 69.56,30.39 69.56,27.94
N$16
  Bottom 0.254: RT4.2 86.09,36.1 U3.P$6
N$17
  Bottom 0.254: U4.6 64.94,26.46 62.95,26.46 62.75,26.67 R8.2
N$18
  Top 0.254: RT15.1 82.46,19.96 RT16.2
N$19
  Bottom 0.508: LCD1.3 22.54,91.63 R1.S
N$28
  Bottom 0.508: LCD1.15 53.02,91.63 RT6.2
N$33
  Top 0.254: R9.1 94.93,22.65 LED6.A
N$38
  Top 0.254: LED4.A 94.93,27.52 R12.1
PB0
  Top 0.254: SD_COMM.6 28.58,20 28.58,18.42 39.04,7.95 73.03,7.95 73.58,8.51 ZU4.12
PB1  (via drill 0.35)
  Top 0.254: SD_COMM.2 28.89,29.85 28.89,25.97 30.88,23.99 34.05,23.99 46.59,11.45 v69.22,11.45 | 74.38,11.2 v74.3,11.11 74.3,12.45 ZU4.13
  Bottom 0.254: v69.22,11.45 73.96,11.45 v74.3,11.11
PC0  (via drill 0.35)
  Top 0.254: RT10.1 46.29,54.66 S2.2 S2.1 46.32,38.46 60.96,23.81 v65.09,23.81 | ZU4.23 78.51,19.07 79.02,19.07 79.18,19.23 79.18,20.02 79.02,20.19 78.63,20.19 v77.59,21.23
  Bottom 0.254: v77.59,21.23 76.52,22.3 76.52,23.5 76.2,23.81 v65.09,23.81
PC1  (via drill 0.35)
  Top 0.254: S1.2 15.81,54.66 RT9.1 | v66.36,16.57 36.9,46.04 17.98,46.04 S1.1 | v76.52,19.69 78.21,19.69 ZU4.24
  Bottom 0.254: v66.36,16.57 67.61,17.82 67.61,18.69 67.99,19.07 70.4,19.07 70.74,18.73 75.57,18.73 v76.52,19.69 | S1.1 S1.2
RESET  (via drill 0.35)  (1 unrouted)
  Top 0.203: C7.2 72.39,38.95 72.39,38.74 | 73.58,21.91 73.53,21.96 73.53,37.19
  Top 0.254: C7.1 74.43,38.82 U6.2 | 73.58,22.23 73.58,21.91 ZU4.29 73.64,21.06 73.64,19.41 74.32,18.73 v76.84,18.73 | 73.53,37.19 73.53,37.23 73.18,37.58 73.14,37.58 72.39,38.33 72.39,38.74 | 80.96,22.23 81.93,22.23 83.5,20.65 83.5,18.93 83.99,18.44 85.7,18.44 ICSP.5 91.15,12.99 R14.1 | 80.96,22.23 79.06,22.23 78.85,22.43 D4.A v78.74,21.27 | RT15.2 80.96,22.23
  Bottom 0.254: v76.84,18.73 78.74,20.64 v78.74,21.27
RS  (via drill 0.35)
  Top 0.254: LCD1.4 28.13,88.72 50.43,88.72 68.44,70.71 68.44,21.59 67.2,20.35 67.2,17.6 68.26,16.53 v68.26,16.51 | v73.03,13.97 73.03,13.29 73.02,13.29 73.02,12.78 ZU4.11
  Bottom 0.254: v68.26,16.51 70.06,14.72 70.06,13.53 70.68,12.91 71.94,12.91 73,13.97 v73.03,13.97
RXLED
  Top 0.254: 83.5,35.56 83.5,35.57 U6.22 84.1,35.37 83.49,35.37 83.19,35.07 83.19,30.48 86.36,27.31 LED4.C
SCK  (via drill 0.35)
  Top 0.254: 77.47,13.02 77.47,13.23 ZU4.17 | ICSP.3 89.64,11.96 88.15,11.96 87.09,13.02 77.47,13.02 | SD_COMM.4 30.48,23.18 33.66,23.18 46.99,9.84 v71.76,9.84 | v77.59,11.75 77.59,12.9 77.47,13.02
  Bottom 0.254: v71.76,9.84 77.15,9.84 77.59,10.28 v77.59,11.75
SCL  (via drill 0.35)  (1 unrouted)
  Top 0.254: ZU4.28 74.38,19.77 v74.3,19.69 | v74.3,22.88 74.3,26.35 78.42,30.48 v78.42,67.31 86.36,75.25 94.62,75.25 RTC_MOD.4
  Bottom 0.254: U1.6 79.12,67.31 v78.42,67.31 78.11,66.99 RT13.2 | v74.3,19.69 v74.3,22.88
SDA  (via drill 0.35)
  Top 0.254: ZU4.27 75.18,19.76 v75.25,19.69 | RTC_MOD.5 94.93,72.71 93.03,70.8 85.78,70.8 v79.43,64.45 78.83,63.85 78.83,30.31 75.23,26.71 75.23,24.49 75.25,24.47 v75.25,22.88 | RTC_MOD.5
  Bottom 0.254: v75.25,19.69 v75.25,22.88 | U1.5 79.75,64.77 v79.43,64.45 79.12,64.77 RT14.2
SQW  (1 unrouted)
TXLED
  Top 0.254: 83.5,36.2 83.5,36.22 U6.23 83.58,36.22 83.1,35.74 83.1,35.56 82.78,35.24 82.78,30.31 90.23,22.86 LED6.C
VBATT  (via drill 0.35)  (1 unrouted)
  Top 0.508: v80.01,40.96 v80.01,37.78
  Bottom 0.508: 80,31.75 80,26.67 79.68,26.35 77.47,26.35 | 80,31.75 80,34.33 79.73,34.33 C3.1 | C3.1 80.07,34.67 82.5,34.67 84.09,36.26 U3.P$10 | U3.P$10 84.56,36.6 84.56,36.82 84.56,36.83 84.32,36.83 U3.P$10 | 77.47,26.35 73.66,26.35 | 73.66,26.35 U4.3 | L1.P$1 75.13,31.75 80,31.75 | 77.47,26.35 C6.1 | 73.66,26.35 R10.2 | C3.1 80.01,34.61 v80.01,37.78 | CN2.2 80.22,41.17 v80.01,40.96
XTAL1
  Top 0.254: Y2.3 63.87,15.24 65.94,15.24 R11.1 ZU4.7
XTAL2
  Top 0.254: ZU4.8 68.68,13.02 66.46,13.02 R11.2 63.99,13.12 Y2.1

### Text on the board
tNames: CHRG | AUX PWR | USB-UART | 5v | PWR | RX | SD CARD | TX | Finger Print Attendance System / GT-521F32 / By Derek Fronek / rev 1.0 2018
bNames: LCD Contrast
Measures: Units: Inches